# Altium schematic sheet STM32F1_board.SchDoc
size A4; SheetNumber: 1; SheetTotal: 1
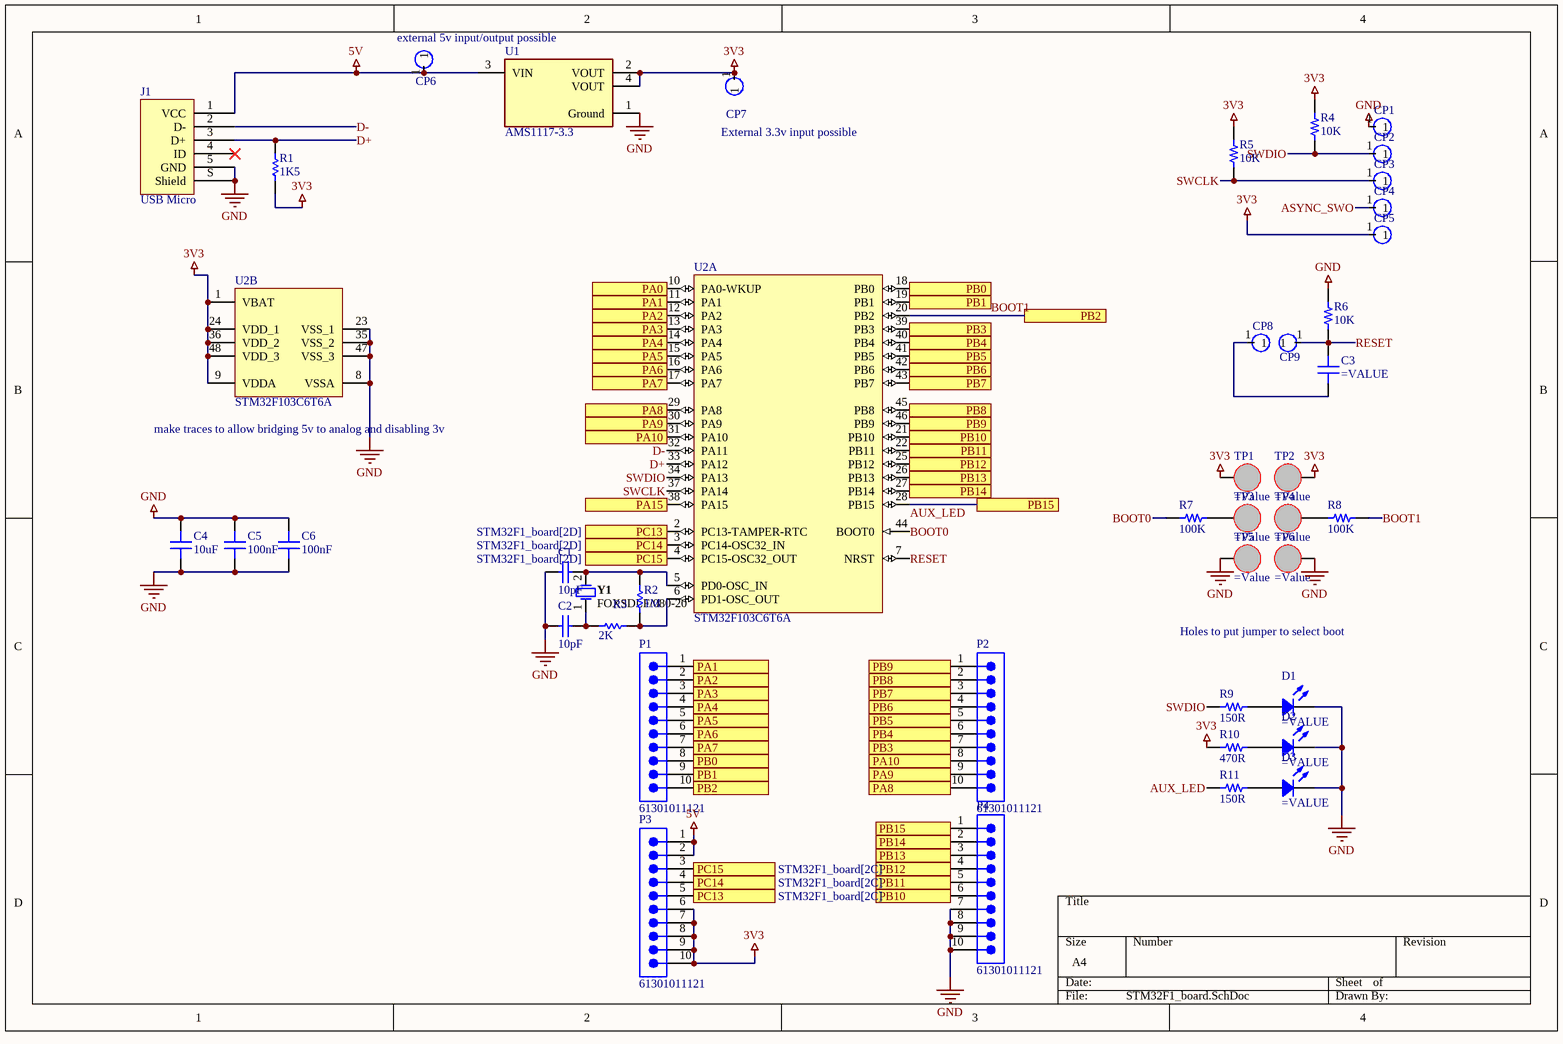
[diagram p0: STM32F1_board.SchDoc]

## Parts
C1  value 10pF  [CAP FILM 0603_1608]  (hidden comment: Capacitor)
C2  value 10pF  [CAP FILM 0603_1608]  (hidden comment: Capacitor)
C3  (no value)  [CAP FILM 0603_1608]
C4  10uF  [CAP FILM 0603_1608]
C5  100nF  [CAP FILM 0603_1608]
C6  100nF  [CAP FILM 0603_1608]
CP1  CONNECT_PAD  [PAD_SQUARE]  (value not drawn)
CP2  CONNECT_PAD  [PAD_SQUARE]  (value not drawn)
CP3  CONNECT_PAD  [PAD_SQUARE]  (value not drawn)
CP4  CONNECT_PAD  [PAD_SQUARE]  (value not drawn)
CP5  CONNECT_PAD  [PAD_SQUARE]  (value not drawn)
CP6  CONNECT_PAD  [PAD_SQUARE]  (value not drawn)
CP7  CONNECT_PAD  [PAD_SQUARE]  (value not drawn)
CP8  CONNECT_PAD  [PAD_SQUARE]  (value not drawn)
CP9  CONNECT_PAD  [PAD_SQUARE]  (value not drawn)
D1  (no value)  [RES 0603_1608]
D2  (no value)  [RES 0603_1608]
D3  (no value)  [RES 0603_1608]
J1  USB Micro  [FCI USB 10033526-N3212LF]
P1  61301011121  [61301011121]
P2  61301011121  [61301011121]
P3  61301011121  [61301011121]
P4  61301011121  [61301011121]
R1  value 1K5  [SMD-0603-RES]  (hidden comment: Resistor)
R2  value 1M  [SMD-0603-RES]  (hidden comment: Resistor)
R3  value 2K  [SMD-0603-RES]  (hidden comment: Resistor)
R4  10K  [SMD-0603-RES]
R5  10K  [SMD-0603-RES]
R6  10K  [SMD-0603-RES]
R7  100K  [SMD-0603-RES]
R8  100K  [SMD-0603-RES]
R9  150R  [SMD-0603-RES]
R10  470R  [SMD-0603-RES]
R11  150R  [SMD-0603-RES]
TP1  (no value)  [PCBComponent_1]
TP2  (no value)  [PCBComponent_1]
TP3  (no value)  [PCBComponent_1]
TP4  (no value)  [PCBComponent_1]
TP5  (no value)  [PCBComponent_1]
TP6  (no value)  [PCBComponent_1]
U1  AMS1117-3.3  [FP-AMS1117-IPC_C]
U2  STM32F103C6T6A  [STM-LQFP48_M]  (parts A,B of 2)
Y1  FOXSDLF/080-20  [FOX-HC49SDLF_V]

## Ports
PA0, PA1 (see STM32F1_board[2B]), PA1 (see STM32F1_board[2C]), PA2 (see STM32F1_board[2B]), PA2 (see STM32F1_board[2C]), PA3 (see STM32F1_board[2B]), PA3 (see STM32F1_board[2C]), PA4 (see STM32F1_board[2B]), PA4 (see STM32F1_board[2C]), PA5 (see STM32F1_board[2B]), PA5 (see STM32F1_board[2C]), PA6 (see STM32F1_board[2B]), PA6 (see STM32F1_board[2C]), PA7 (see STM32F1_board[2B]), PA7 (see STM32F1_board[2C]), PA8 (see STM32F1_board[2B]), PA8 (see STM32F1_board[3D]), PA9 (see STM32F1_board[2B]), PA9 (see STM32F1_board[3D]), PA10 (see STM32F1_board[2B]), PA10 (see STM32F1_board[3C]), PA15, PB0 (see STM32F1_board[2C]), PB0 (see STM32F1_board[3B]), PB1 (see STM32F1_board[2D]), PB1 (see STM32F1_board[3B]), PB2 (see STM32F1_board[2D]), PB2 (see STM32F1_board[3B]), PB3 (see STM32F1_board[3B]), PB3 (see STM32F1_board[3C]), PB4 (see STM32F1_board[3B]), PB4 (see STM32F1_board[3C]), PB5 (see STM32F1_board[3B]), PB5 (see STM32F1_board[3C]), PB6 (see STM32F1_board[3B]), PB6 (see STM32F1_board[3C]), PB7 (see STM32F1_board[3B]), PB7 (see STM32F1_board[3C]), PB8 (see STM32F1_board[3B]), PB8 (see STM32F1_board[3C]), PB9 (see STM32F1_board[3B]), PB9 (see STM32F1_board[3C]), PB10 (see STM32F1_board[3B]), PB10 (see STM32F1_board[3D]), PB11 (see STM32F1_board[3B]), PB11 (see STM32F1_board[3D]), PB12 (see STM32F1_board[3B]), PB12 (see STM32F1_board[3D]), PB13 (see STM32F1_board[3B]), PB13 (see STM32F1_board[3D]), PB14 (see STM32F1_board[3B]), PB14 (see STM32F1_board[3D]), PB15 (see STM32F1_board[3B]), PB15 (see STM32F1_board[3D]), PC13 (see STM32F1_board[2C]), PC13 (see STM32F1_board[2D]), PC14 (see STM32F1_board[2C]), PC14 (see STM32F1_board[2D]), PC15 (see STM32F1_board[2C]), PC15 (see STM32F1_board[2D])

## Nets
3V3: CP5.1 CP7.1 P3.6 P3.7 P3.8 P3.9 P3.10 R1.2 R4.2 R5.2 R10.1 TP1.1(Test_Point) TP2.1(Test_Point) U1.2(VOUT) U1.4(VOUT) U2.1(VBAT) U2.9(VDDA) U2.24(VDD_1) U2.36(VDD_2) U2.48(VDD_3)
5V: CP6.1 J1.1(VCC) P3.1 P3.2 U1.3(VIN)
GND: C1.1 C2.1 C4.1 C4.2 C5.1 C5.2 C6.1 C6.2 CP1.1 D1.2 D2.2 D3.2 J1.5(GND) J1.S(Shield) P4.7 P4.8 P4.9 P4.10 R6.2 TP5.1(Test_Point) TP6.1(Test_Point) U1.1(Ground) U2.8(VSSA) U2.23(VSS_1) U2.35(VSS_2) U2.47(VSS_3)
ASYNC_SWO: CP4.1 P2.7 U2.39(PB3) ; port PB3
AUX_LED: P4.1 R11.1 U2.28(PB15) ; port PB15
BOOT0: R7.1 U2.44(BOOT0)
BOOT1: P1.10 R8.2 U2.20(PB2) ; port PB2
D+: J1.3(D+) R1.1 U2.33(PA12)
D-: J1.2(D-) U2.32(PA11)
PA0: U2.10(PA0-WKUP) ; port PA0
PA1: P1.1 U2.11(PA1) ; port PA1
PA2: P1.2 U2.12(PA2) ; port PA2
PA3: P1.3 U2.13(PA3) ; port PA3
PA4: P1.4 U2.14(PA4) ; port PA4
PA5: P1.5 U2.15(PA5) ; port PA5
PA6: P1.6 U2.16(PA6) ; port PA6
PA7: P1.7 U2.17(PA7) ; port PA7
PA8: P2.10 U2.29(PA8) ; port PA8
PA9: P2.9 U2.30(PA9) ; port PA9
PA10: P2.8 U2.31(PA10) ; port PA10
PA15: U2.38(PA15) ; port PA15
PB0: P1.8 U2.18(PB0) ; port PB0
PB1: P1.9 U2.19(PB1) ; port PB1
PB4: P2.6 U2.40(PB4) ; port PB4
PB5: P2.5 U2.41(PB5) ; port PB5
PB6: P2.4 U2.42(PB6) ; port PB6
PB7: P2.3 U2.43(PB7) ; port PB7
PB8: P2.2 U2.45(PB8) ; port PB8
PB9: P2.1 U2.46(PB9) ; port PB9
PB10: P4.6 U2.21(PB10) ; port PB10
PB11: P4.5 U2.22(PB11) ; port PB11
PB12: P4.4 U2.25(PB12) ; port PB12
PB13: P4.3 U2.26(PB13) ; port PB13
PB14: P4.2 U2.27(PB14) ; port PB14
PC13: P3.5 U2.2(PC13-TAMPER-RTC) ; port PC13
PC14: P3.4 U2.3(PC14-OSC32_IN) ; port PC14
PC15: P3.3 U2.4(PC15-OSC32_OUT) ; port PC15
RESET: C3.2 CP9.1 R6.1 U2.7(NRST)
SWCLK: CP3.1 R5.1 U2.37(PA14)
SWDIO: CP2.1 R4.1 R9.1 U2.34(PA13)
NetC1_2: C1.2 R2.2 U2.5(PD0-OSC_IN) Y1.2
NetC2_2: C2.2 R3.1 Y1.1
NetC3_1: C3.1 CP8.1
NetD1_1: D1.1 R9.2
NetD2_1: D2.1 R10.2
NetD3_1: D3.1 R11.2
NetR2_1: R2.1 R3.2 U2.6(PD1-OSC_OUT)
NetR7_2: R7.2 TP3.1(Test_Point)
NetR8_1: R8.1 TP4.1(Test_Point)

Not connected (* = marked no-connect by the designer): J1 4(ID)*

## Notes on the sheet
- external 5v input/output possible
- (near CP7) External 3.3v input possible
- (near U2) make traces to allow bridging 5v to analog and disabling 3v
- Holes to put jumper to select boot

## Library data of the parts
C1 C2 = Capacitor: SimulationGenericComponent: True
C3-C6 = Capacitor: SMT Capacitor
  C4: VALUE: 10uF
  C5 C6: VALUE: 100nF
D1 = LED: orange
D2 = LED: green
D3 = LED: blue
J1 = USB 2.0 Type B Micro
P1-P4 = CMP-1502-01082-4: NexarPartId: 18818159; Operating Supply Voltage: 250V; Insulation Resistance: 1GΩ; Contact Resistance: 20mΩ; Current Rating: 3A; Connector Type: Male Pin; Gender: Male; Number of Contacts: 10; Pitch: 2.54mm; REACH SVHC: Unknown; Min Operating Temperature: -40°C; Max Operating Temperature: 105°C; Height: 8.74mm; Packaging: Bulk; Orientation: Vertical; Number of Pins: 10; Contact Mating Length: 5.9944mm; Voltage Rating: 250V; Number of Positions: 10; Termination: Solder; Number of Rows: 1; Contact Material: Copper; Housing Material: PBT; Mount: Through Hole; Lead Pitch: 2.54mm; Contact Plating: Gold; Contact Gender: Male; Color: Black; Flammability Rating: UL94 V-0; RoHS: Compliant; Width: 25.4mm; Length: 2.54mm
R1-R3 = Resistor: TC1: 0; SimulationGenericComponent: True; TC2: 0
R4-R11 = Resistor: SMT Resistor
  R4-R6: VALUE: 10K
  R7 R8: VALUE: 100K
  R9 R11: VALUE: 150R
  R10: VALUE: 470R
TP1-TP6 = TEST_PAD
U1 = CMP-209535-000001-1: LDO Voltage Regulators 1A, 3.3V; Manufacturer: Advanced Monolithic Systems; Dropout Voltage: 1.1V; Output Type: Fixed; Nominal Supply Current: 5mA; Max Power Dissipation: 1.2W; Max Supply Voltage: 15V; Number Of Outputs: 1; Standoff Height: 0.64mm; Max Junction Temp: +125°C; Height: 1.8mm; Package: AMS1117; Device Class L2: Power Management ICs; ComponentLink2Description: Datasheet; ComponentLink2URL: http://www.advanced-monolithic.com/pdf/ds1117.pdf; Category: IC; RoHS: TRUE; Automotive: No; Device Class L1: Integrated Circuits (ICs); Output Current: 1A; Device Class L3: Voltage Regulators - Linear; Temperature: -40°C to +125°C; Output Voltage: 3.3V; Manufacturer Part Number: AMS1117-3.3; Temperature Range Low: -40°C; Octopart: https://octopart.com/ams1117-3.3-advanced+monolithic+systems-25899300; Lead Free: Yes; Ipc Land Pattern Name: SOT229P700X180-4; Temperature Range High: +125°C
U2 = CMP-0237-00254-3: ARM Cortex-M3 32-bit MCU, 32 KB Flash, 10 KB Internal RAM, 37 I/Os, 48-pin LQFP, -40 to 85 degC, Tray; Operating Frequency(F) (Processor speed) (MHz): 72; A/D Converter: 2x12-bit (10 Channel); Supply Voltage(Vcc) min (V): 2; FLASH Size (Prog) (kB): 32; I/Os (High Current): 37; Internal RAM Size (kB): 10; PackageVersion: Rev. 6, 06/2013; ComponentLink3Description: Package Specification; ComponentLink2URL: http://www.st.com/st-web-ui/static/active/en/resource/technical/document/datasheet/CD00210843.pdf; ComponentLink1URL: http://www.st.com/web/en/home.html; PackageDescription: 48-Pin Low Profile Quad Flat Package, 7 x 7 mm Body, 0.5 mm Pitch; PartNumber: STM32F103C6T6A; ComponentLink3URL: http://www.st.com/st-web-ui/static/active/en/resource/technical/document/datasheet/DM00058181.pdf; PackageReference: LQFP48; Packing: Tray; ComponentLink2Description: Datasheet; Mounting Technology: Surface Mount; ComponentLink1Description: Manufacturer URL; Core: ARM Cortex-M3; DatasheetVersion: Rev. 6
Y1 = CMP-2100-03639-1: Resistance Weld Crystal, 8 MHz, +/- 30 ppm, -20 to 70 degC, 2-Pin SMD, RoHS, Tape and Reel; Manufacturer: FOX Electronics; Series Resistance: 80Ohm; Frequency: 8MHz; Load Capacitance: 20pF; Tolerance: 50ppm; Frequency Tolerance: 30ppm; Datasheet URL: http://www.foxonline.com/pdfs/hc49sdlf.pdf; Package Reference: HC49SDLF; Height: 4.5mm; Mount: SurfaceMount; Packaging: TapeandReel; Length: 11.7mm; Termination: SMD/SMT; Number of Pins: 2; Depth: 5mm; Min Operating Temperature: -20degC; Package Quantity: 1000; RoHSCompliant: True; Lead Free: LeadFree; Width: 5mm; Case/Package: SMD/SMT; Manufacturer URL: http://www.foxonline.com/; Max Operating Temperature: 70degC; REACH SVHC: NoSVHC; Datasheet Version: 42064.0; Package Description: 2-Pin Surface Mount Device, Body 5 x 11.7 mm; Frequency Stability: 50ppm; ESR (Equivalent Series Resistance): 80Ohm; Radiation Hardening: No